# EAGLE design shield (EAGLE 7.1.0)
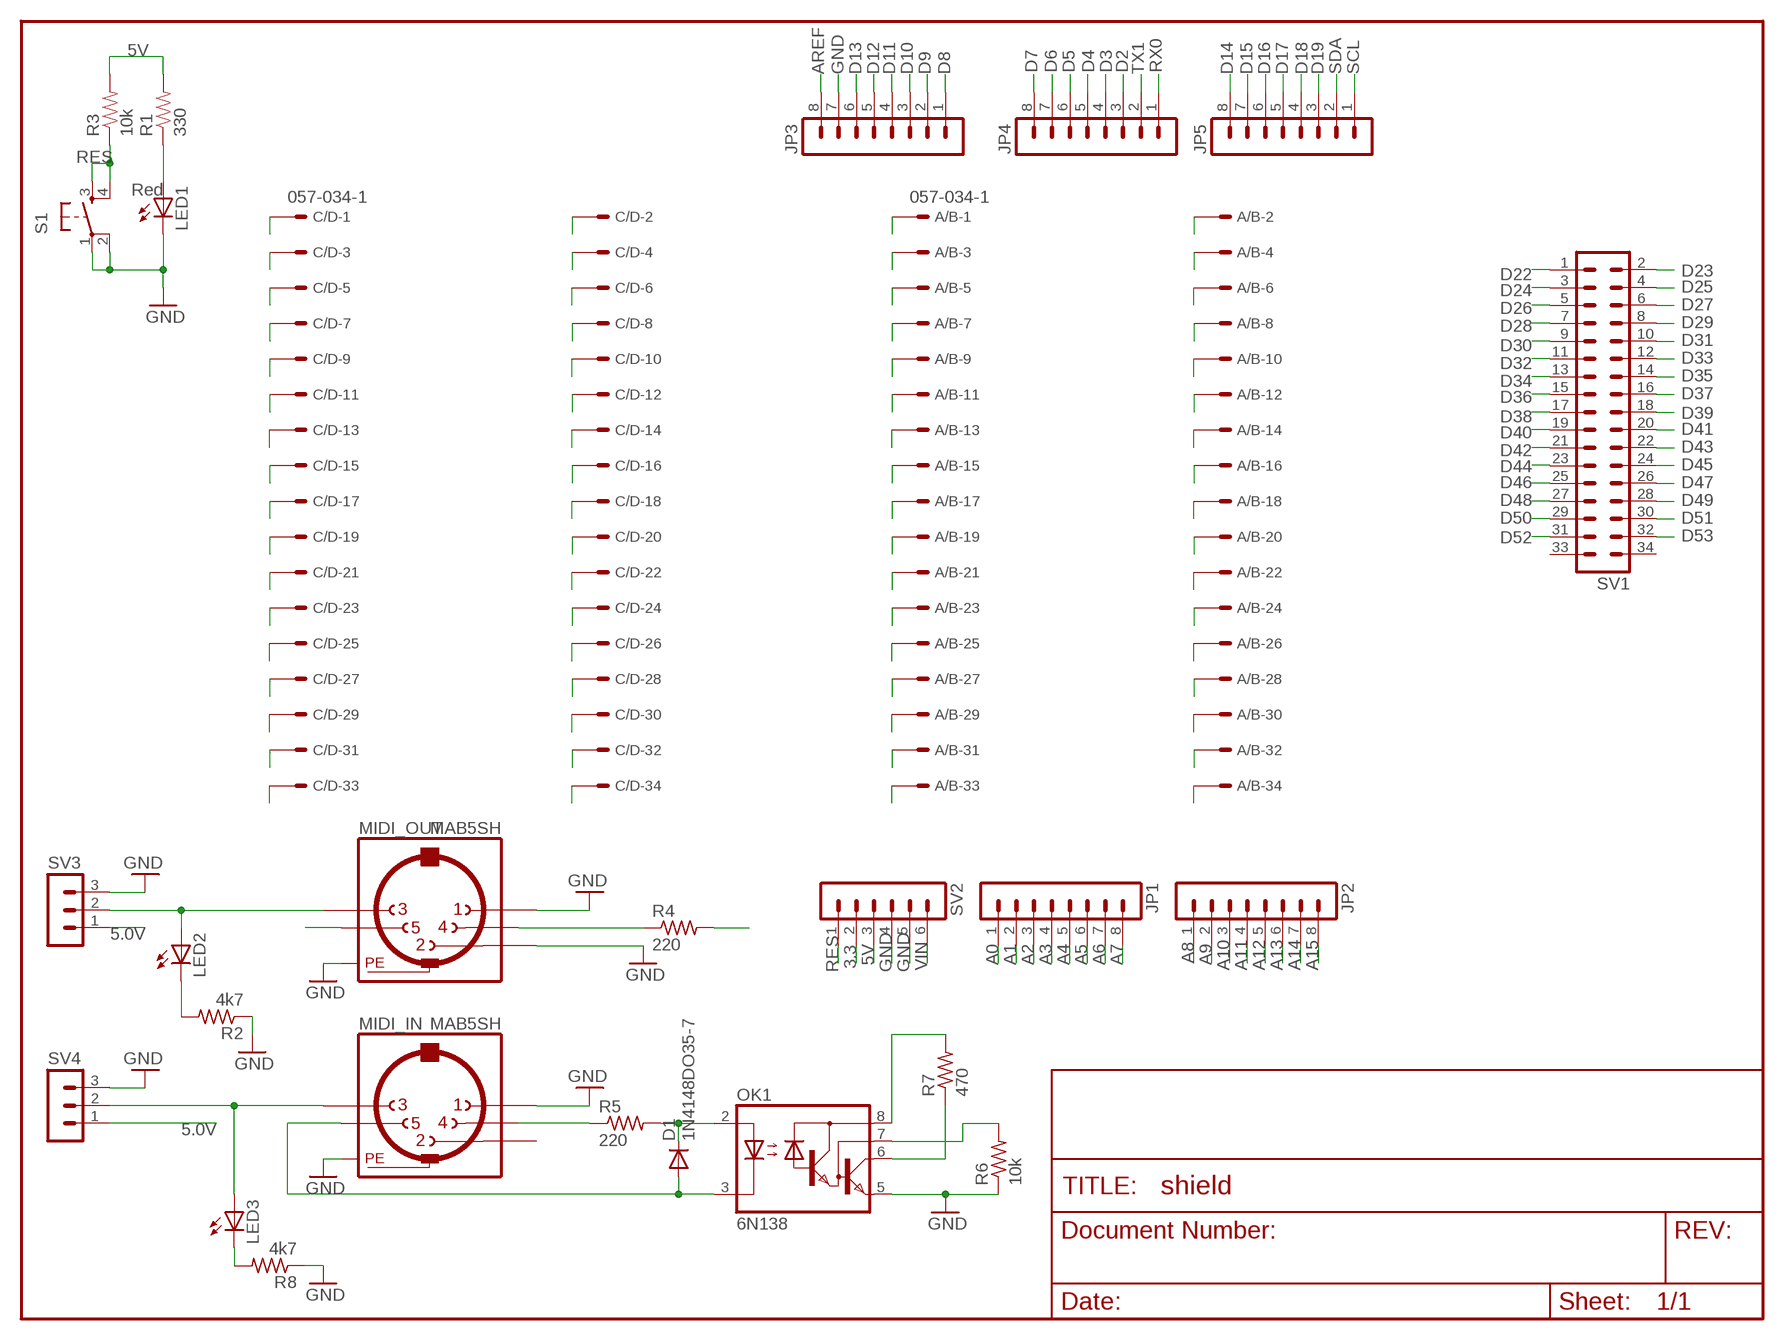
[diagram p0: schematic, sheet 1]

## Parts
A/B  057-034-1  [057-034-1]
C/D  057-034-1  [057-034-1]
D1  1N4148DO35-7  [DO35-7]
JP1  MA08-1  [MA08-1]
JP2  MA08-1  [MA08-1]
JP3  MA08-1  [MA08-1]
JP4  MA08-1  [MA08-1]
JP5  MA08-1  [MA08-1]
LED1  Red  LED5MM  [LED5MM]
LED2  LEDLSU260  [LSU260]
LED3  LEDLSU260  [LSU260]
MIDI_IN  MAB5SH  [MAB5SH]
MIDI_OUT  MAB5SH  [MAB5SH]
OK1  6N138  [DIL08]
R1  330  RESISTORPTH1  [AXIAL-0.3]
R2  4k7  R-US_0204/7  [0204/7]
R3  10k  RESISTORPTH1  [AXIAL-0.3]
R4  220  R-US_0204/7  [0204/7]
R5  220  R-US_0204/7  [0204/7]
R6  10k  R-US_0204/7  [0204/7]
R7  470  R-US_0204/7  [0204/7]
R8  4k7  R-US_0204/7  [0204/7]
S1  TAC_SWITCHPTH  [TACTILE-PTH]
SV1  MA17-2  [MA17-2]
SV2  MA06-1  [MA06-1]
SV3  MA03-1  [MA03-1]
SV4  MA03-1  [MA03-1]

## Nets
3.3: SV2.2
5V: A/B.33 C/D.2 C/D.33 OK1.8(VCC) R1.P$2 R3.P$2 R4.2 R7.2 SV2.3 SV3.1 SV4.1
A0: JP1.1
A1: JP1.2
A2: JP1.3
A3: JP1.4
A4: C/D.9 JP1.5
A5: C/D.11 JP1.6
A6: C/D.13 JP1.7
A7: C/D.15 JP1.8
A8: C/D.17 JP2.1
A9: C/D.19 JP2.2
A10: C/D.21 JP2.3
A11: C/D.23 JP2.4
A12: C/D.25 JP2.5
A13: C/D.27 JP2.6
A14: C/D.29 JP2.7
A15: C/D.31 JP2.8
AREF: JP3.8
D2: A/B.26 JP4.3
D3: A/B.24 JP4.4
D4: A/B.22 JP4.5
D5: A/B.20 JP4.6
D6: A/B.18 JP4.7
D7: A/B.16 JP4.8
D8: A/B.14 JP3.1
D9: A/B.12 JP3.2
D10: A/B.10 JP3.3
D11: A/B.8 JP3.4
D12: A/B.6 JP3.5
D13: A/B.4 JP3.6
D14: JP5.8
D15: JP5.7
D16: JP5.6
D17: JP5.5
D18: JP5.4 MIDI_OUT.5
D19: JP5.3 OK1.6(VO) R7.1
D22: A/B.9 SV1.1
D23: A/B.11 SV1.2
D24: A/B.13 SV1.3
D25: A/B.15 SV1.4
D26: A/B.17 SV1.5
D27: A/B.19 SV1.6
D28: A/B.21 SV1.7
D29: A/B.31 SV1.8
D30: A/B.29 SV1.9
D31: A/B.27 SV1.10
D32: A/B.25 SV1.11
D33: A/B.23 SV1.12
D34: C/D.4 SV1.13
D35: C/D.6 SV1.14
D36: C/D.8 SV1.15
D37: C/D.10 SV1.16
D38: C/D.12 SV1.17
D39: C/D.14 SV1.18
D40: C/D.16 SV1.19
D41: C/D.18 SV1.20
D42: C/D.20 SV1.21
D43: C/D.22 SV1.22
D44: C/D.24 SV1.23
D45: C/D.26 SV1.24
D46: SV1.25
D47: SV1.26
D48: SV1.27
D49: SV1.28
D50: SV1.29
D51: SV1.30
D52: SV1.31
D53: SV1.32
GND: A/B.34 C/D.34 JP3.7 LED1.K(C) MIDI_IN.1 MIDI_IN.PE MIDI_IN.PE@(PE) MIDI_OUT.1 MIDI_OUT.2 MIDI_OUT.PE MIDI_OUT.PE@(PE) OK1.5(GND) R2.1 R6.1 R8.1 S1.1 S1.2 SV2.4 SV2.5 SV3.3 SV4.3
N$1: LED3.A MIDI_IN.3 SV4.2
N$2: LED2.A MIDI_OUT.3 SV3.2
N$3: MIDI_OUT.4 R4.1
N$4: LED2.K(C) R2.2
N$5: D1.C OK1.2(A) R5.2
N$6: MIDI_IN.4 R5.1
N$7: D1.A MIDI_IN.5 OK1.3(C)
N$8: OK1.7(VB) R6.2
N$10: A/B.1
N$13: LED3.K(C) R8.2
N$19: A/B.2
N$24: A/B.3
N$25: A/B.5
N$26: A/B.7
N$31: A/B.28
N$32: C/D.1
N$40: C/D.32
N$41: C/D.28
N$42: C/D.30
N$51: C/D.3
N$52: C/D.5
N$53: C/D.7
N$76: A/B.30
N$77: A/B.32
N$126: LED1.A R1.P$1
RES: R3.P$1 S1.3 S1.4 SV2.1
RX0: JP4.1
SCL: JP5.1
SDA: JP5.2
TX1: JP4.2
VIN: SV2.6
Unconnected: MIDI_IN.2 SV1.33 SV1.34

## Library data of the parts
A/B C/D = con-panduit:057-034-: CONNECTOR 34-pin series 057 contact pc board low profile headers; OC_FARNELL: unknown; OC_NEWARK: unknown
D1 = diode:1N4148: DIODE high speed (Philips)
JP1-JP5 = con-lstb:MA08-1: PIN HEADER; OC_FARNELL: unknown; OC_NEWARK: unknown
LED1 = SparkFun:LED: LEDs Standard schematic elements and footprints for 5mm, 3mm, 1206, and 0603 sized LEDs. 5mm - Spark Fun Electronics SKU : COM-00529 (and others)
LED2 LED3 = led:LED: LED OSRAM: - CHIPLED LG R971, LG N971, LY N971, LG Q971, LY Q971, LO R971, LY R971 LH N974, LH R974 LS Q976, LO Q976, LY Q976 LO Q996 - Hyper CHIPLED LW Q18S LB Q993, LB Q99A, LB R99A - SideLED LS A670, LO A670, LY A670, LG A670, LP A670 LB A673, LV A673, LT A673, LW A673 LH A674 LY A675 LS A676, LA A676, LO A676, LY A676, LW A676 LS A679, LY A679, LG A679 - Hyper Micro SIDELED® LS Y876, LA Y876, LO Y876, LY Y876 LT Y87S - SmartLED LW L88C, LW L88S LB L89C, LB L89S, LG L890 LS L89K, LO L89K, LY L89K LS L896, LA L896, LO L896, LY L896 - TOPLED LS T670, LO T670, LY T670, LG T670, LP T670 LSG T670, LSP T670, LSY T670, LOP T670, LYG T670 LG T671, LOG T671, LSG T671 LB T673, LV T673, LT T673, LW T673 LH T674 LS T676, LA T676, LO T676, LY T676, LB T676, LH T676, LSB T676, LW T676 LB T67C, LV T67C, LT T67C, LS T67K, LO T67K, LY T67K, LW E67C LS E67B, LA E67B, LO E67B, LY E67B, LB E67C, LV E67C, LT E67C LW T67C LS T679, LY T679, LG T679 LS T770, LO T770, LY T770, LG T770, LP T770 LB T773, LV T773, LT T773, LW T773 LH T774 LS E675, LA E675, LY E675, LS T675 LS T776, LA T776, LO T776, LY T776, LB T776 LHGB T686 LT T68C, LB T68C - Hyper Mini TOPLED® LB M676 - Mini TOPLED Santana® LG M470 LS M47K, LO M47K, LY M47K Source: http://www.osram.convergy.de LUXEON: - LUMILED® LXK2-PW12-R00, LXK2-PW12-S00, LXK2-PW14-U00, LXK2-PW14-V00 LXK2-PM12-R00, LXK2-PM12-S00, LXK2-PM14-U00 LXK2-PE12-Q00, LXK2-PE12-R00, LXK2-PE12-S00, LXK2-PE14-T00, LXK2-PE14-U00 LXK2-PB12-K00, LXK2-PB12-L00, LXK2-PB12-M00, LXK2-PB14-N00, LXK2-PB14-P00, LXK2-PB14-Q00 LXK2-PR12-L00, LXK2-PR12-M00, LXK2-PR14-Q00, LXK2-PR14-R00 LXK2-PD12-Q00, LXK2-PD12-R00, LXK2-PD12-S00 LXK2-PH12-R00, LXK2-PH12-S00 LXK2-PL12-P00, LXK2-PL12-Q00, LXK2-PL12-R00 Source: www.luxeon.com KINGBRIGHT: KA-3528ASYC Source: www.kingbright.com
MIDI_IN MIDI_OUT = con-hirschmann:MAB5SH: Female CONNECTOR 5 pins 90 deg. with shield, horizontal (DIN 41524); OC_FARNELL: 809883; OC_NEWARK: unknown
OK1 = optocoupler:6N138: MOTOROLA OPTO COUPLER; MF: VISHAY/TELEFUNKEN; MPN: 6N138; OC_FARNELL: 9860150; OC_NEWARK: 35K5294
R1 R3 = SparkFun:RESISTOR: Resistor Basic schematic elements and footprints for 0603, 1206, and PTH 1/10th watt (small) resistors.
R2 R8 = resistor:R-US_: RESISTOR, American symbol
R4-R7 = rcl:R-US_: RESISTOR, American symbol
S1 = SparkFun:TAC_SWITCH: Momentary Switch Button commonly used for reset or general input. Spark Fun Electronics SKU : COM-00097
SV1 = con-lstb:MA17-2: PIN HEADER; OC_FARNELL: unknown; OC_NEWARK: unknown
SV2 = con-lstb:MA06-1: PIN HEADER; OC_FARNELL: unknown; OC_NEWARK: unknown
SV3 SV4 = con-lstb:MA03-1: PIN HEADER; OC_FARNELL: unknown; OC_NEWARK: unknown

## Board
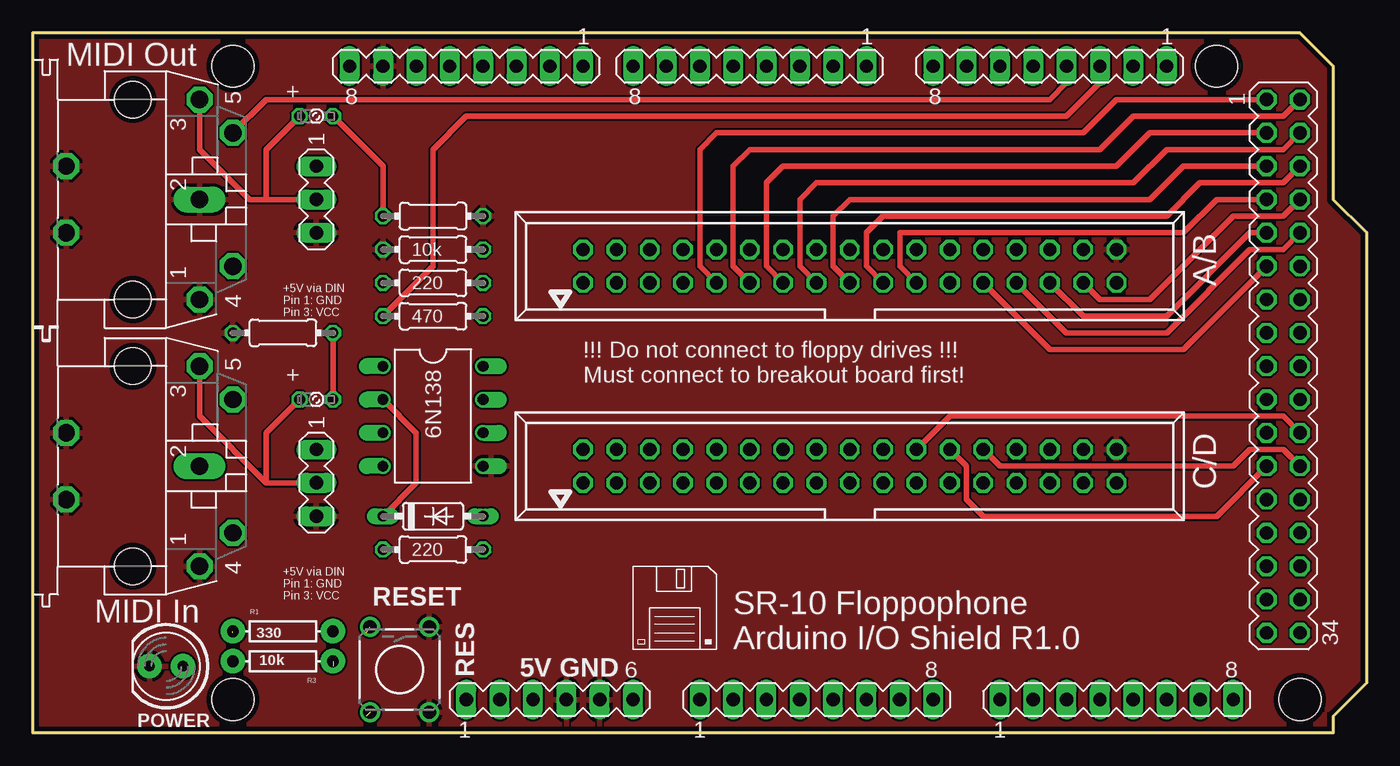
[diagram p1: board, top side]
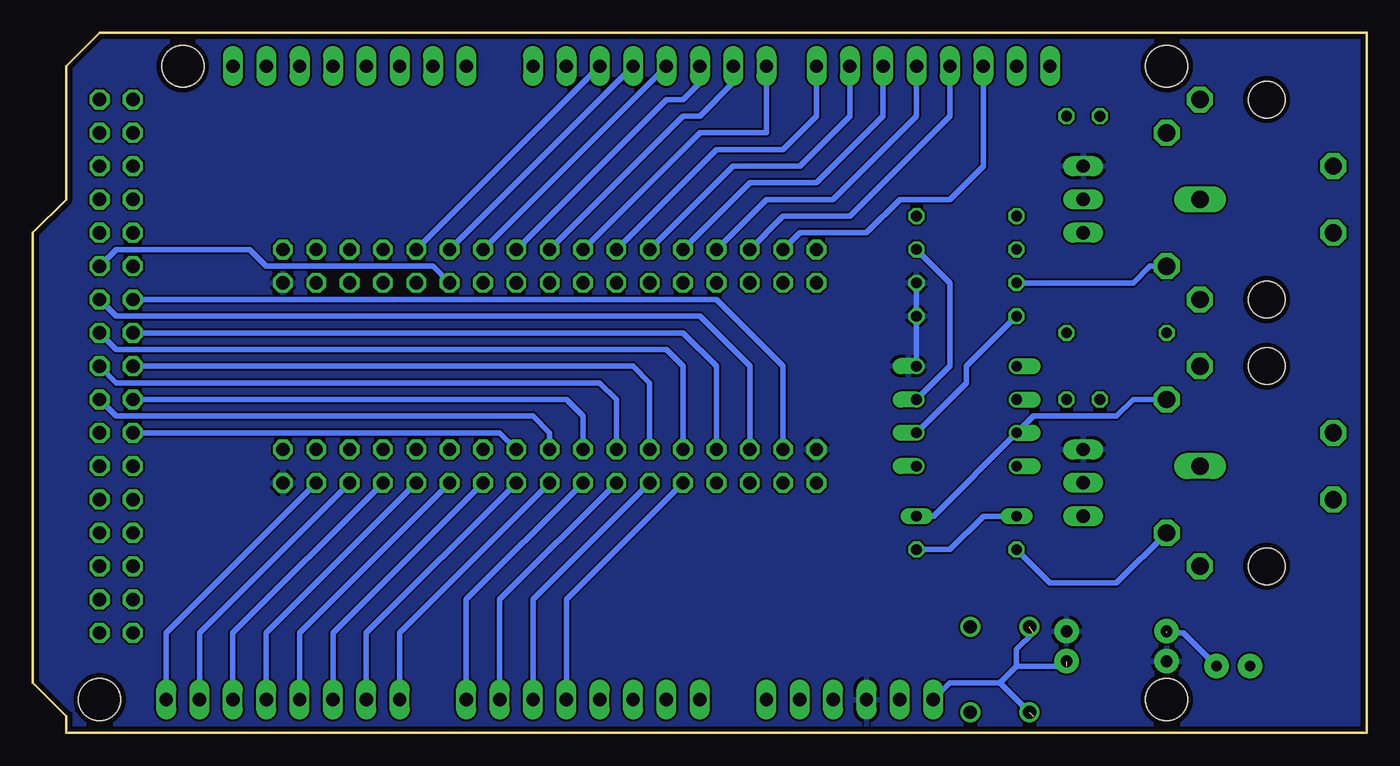
[diagram p2: board, bottom side, seen from below]

Size 101.6 x 53.34 mm. Coordinates in mm from the lower left corner, seen from the top.
Outline: 0,0 99.06,0 99.06,1.27 101.6,3.81 101.6,38.1 99.06,40.64 99.06,50.8 96.52,53.34 0,53.34 0,0
Copper layers (1*16): Top 0.0356mm / dielectric 1.5011mm / Bottom 0.0356mm
Design rules "OSHPark": minimum track width 6mil, minimum drill 13mil, track to track 6mil, track to pad 6mil, pad to pad 6mil, via to via 6mil, smd to smd 6mil, copper to edge 15mil, drill to drill 6mil, minimum pad ring 7mil, minimum via ring 7mil, stop-mask expansion 3mil, vias tented up to drill 0mil, thermal gap 10mil
Holes 3.2 mm at 15.24,2.54 90.17,50.8 96.52,2.54 15.24,50.8

### Footprints (pad centres in the part's own frame; a part is rotated, then mirrored left to right if it is on the bottom)
057-034-1 = drill 1 octagon: 1 -20.32,-1.27; 2 -20.32,1.27; 3 -17.78,-1.27; 4 -17.78,1.27; 5 -15.24,-1.27; 6 -15.24,1.27; 7 -12.7,-1.27; 8 -12.7,1.27; 9 -10.16,-1.27; 10 -10.16,1.27; 11 -7.62,-1.27; 12 -7.62,1.27; 13 -5.08,-1.27; 14 -5.08,1.27; 15 -2.54,-1.27; 16 -2.54,1.27; 17 0,-1.27; 18 0,1.27; 19 2.54,-1.27; 20 2.54,1.27; 21 5.08,-1.27; 22 5.08,1.27; 23 7.62,-1.27; 24 7.62,1.27; 25 10.16,-1.27; 26 10.16,1.27; 27 12.7,-1.27; 28 12.7,1.27; 29 15.24,-1.27; 30 15.24,1.27; 31 17.78,-1.27; 32 17.78,1.27; 33 20.32,-1.27; 34 20.32,1.27
DO35-7 = drill 0.813 long: A 3.81,0; C -3.81,0
MA08-1 = drill 1.016 long: 1 -8.89,0; 2 -6.35,0; 3 -3.81,0; 4 -1.27,0; 5 1.27,0; 6 3.81,0; 7 6.35,0; 8 8.89,0
LED5MM = drill 0.813 pad 1.88: A -1.27,0; K 1.27,0
LSU260 = drill 0.813 octagon: A -1.27,0; K 1.27,0
MAB5SH = drill 1.321 octagon: 1 7.62,5.08; 3 -7.62,5.08; 4 5.08,7.62; 5 -5.08,7.62; PE -2.54,-5.08; PE@ 2.54,-5.08 | drill 1.321 long: 2 0,5.08 | hole 2.794: 7.62,0; -7.62,0
DIL08 = drill 0.813 offset: 1 -3.81,-3.81; 2 -1.27,-3.81; 3 1.27,-3.81; 4 3.81,-3.81; 5 3.81,3.81; 6 1.27,3.81; 7 -1.27,3.81; 8 -3.81,3.81
AXIAL-0.3 = drill 0.9 pad 1.88: P$1 -3.81,0; P$2 3.81,0
0204/7 = drill 0.813 octagon: 1 -3.81,0; 2 3.81,0
TACTILE-PTH = drill 1.016: 1 -3.251,2.261; 2 3.251,2.261; 3 -3.251,-2.261; 4 3.251,-2.261
MA17-2 = drill 1.016 octagon: 1 -20.32,-1.27; 2 -20.32,1.27; 3 -17.78,-1.27; 4 -17.78,1.27; 5 -15.24,-1.27; 6 -15.24,1.27; 7 -12.7,-1.27; 8 -12.7,1.27; 9 -10.16,-1.27; 10 -10.16,1.27; 11 -7.62,-1.27; 12 -7.62,1.27; 13 -5.08,-1.27; 14 -5.08,1.27; 15 -2.54,-1.27; 16 -2.54,1.27; 17 0,-1.27; 18 0,1.27; 19 2.54,-1.27; 20 2.54,1.27; 21 5.08,-1.27; 22 5.08,1.27; 23 7.62,-1.27; 24 7.62,1.27; 25 10.16,-1.27; 26 10.16,1.27; 27 12.7,-1.27; 28 12.7,1.27; 29 15.24,-1.27; 30 15.24,1.27; 31 17.78,-1.27; 32 17.78,1.27; 33 20.32,-1.27; 34 20.32,1.27
MA06-1 = drill 1.016 long: 1 -6.35,0; 2 -3.81,0; 3 -1.27,0; 4 1.27,0; 5 3.81,0; 6 6.35,0
MA03-1 = drill 1.016 long: 1 -2.54,0; 2 0,0; 3 2.54,0

### Placement (x,y rotation side)
A/B  62.23,35.56 0 top
C/D  62.23,20.32 0 top
D1  30.48,16.51 0 top
JP1  59.69,2.54 0 top
JP2  82.55,2.54 0 top
JP3  33.02,50.8 180 top
JP4  54.61,50.8 180 top
JP5  77.47,50.8 180 top
LED1  10.16,5.08 180 top
LED2  21.59,46.99 0 top
LED3  21.59,25.4 0 top
MIDI_IN  7.62,20.32 270 top
MIDI_OUT  7.62,40.64 270 top
OK1  30.48,24.13 270 top
R1  19.05,7.75 0 top
R2  30.48,39.37 180 top
R3  19.05,5.46 180 top
R4  30.48,34.29 0 top
R5  30.48,13.97 0 top
R6  30.48,36.83 0 top
R7  30.48,31.75 0 top
R8  19.05,30.48 0 top
S1  27.94,4.83 270 top
SV1  95.25,27.94 270 top
SV2  39.37,2.54 0 top
SV3  21.59,40.64 270 top
SV4  21.59,19.05 270 top

### Tracks (layer width: path | path; a pad name or v marks a point on that pad's centre or on a via)
5V
  Bottom 0.406: OK1.8 R7.2 R4.2
  pour Bottom: 0,53.34 0,0 99.06,0 99.06,1.27 101.6,3.81 101.6,38.1 99.06,40.64 99.06,50.8 96.52,53.34
A2
  Bottom 0.406: 55.88,3.81 JP1.3
A3
  Bottom 0.406: 58.42,3.81 JP1.4
A4
  Bottom 0.406: JP1.5 60.96,10.16 C/D.9
A5
  Bottom 0.406: 63.5,3.81 JP1.6 63.5,10.16 C/D.11
A6
  Bottom 0.406: JP1.7 66.04,10.16 C/D.13
A7
  Bottom 0.406: JP1.8 68.58,10.16 C/D.15
A8
  Bottom 0.406: JP2.1 73.66,7.62 C/D.17
A9
  Bottom 0.406: JP2.2 76.2,7.62 C/D.19
A10
  Bottom 0.406: JP2.3 78.74,7.62 C/D.21
A11
  Bottom 0.406: JP2.4 81.28,7.62 C/D.23
A12
  Bottom 0.406: JP2.5 83.82,7.62 C/D.25
A13
  Bottom 0.406: JP2.6 86.36,7.62 C/D.27
A14
  Bottom 0.406: JP2.7 88.9,7.62 C/D.29
A15
  Bottom 0.406: JP2.8 91.44,7.62 C/D.31
D2
  Bottom 0.406: JP4.3 A/B.26
D3
  Bottom 0.406: A/B.24 JP4.4
D4
  Bottom 0.406: JP4.5 A/B.22
D5
  Bottom 0.406: JP4.6 50.8,49.53 52.07,48.26 53.34,48.26 A/B.20
D6
  Bottom 0.406: JP4.7 48.26,49.53 50.8,46.99 52.07,46.99 A/B.18
D7
  Bottom 0.406: JP4.8 45.72,45.72 50.8,45.72 A/B.16
D8
  Bottom 0.406: JP3.1 41.91,46.99 44.45,44.45 49.53,44.45 A/B.14
D9
  Bottom 0.406: JP3.2 39.37,46.99 43.18,43.18 48.26,43.18 A/B.12
D10
  Bottom 0.406: JP3.3 36.83,46.99 41.91,41.91 46.99,41.91 A/B.10
D11
  Bottom 0.406: JP3.4 34.29,46.99 40.64,40.64 45.72,40.64 A/B.8
D12
  Bottom 0.406: A/B.6 44.45,39.37 39.37,39.37 31.75,46.99 JP3.5
D13
  Bottom 0.406: 29.21,49.53 JP3.6 29.21,43.18 31.75,40.64 35.56,40.64 38.1,38.1 43.18,38.1 A/B.4
D18
  Top 0.406: MIDI_OUT.5 17.78,48.26 77.47,48.26 78.74,49.53 JP5.4
D19
  Top 0.406: R7.1 30.48,35.56 30.48,44.45 33.02,46.99 78.74,46.99 81.28,49.53 JP5.3
  Bottom 0.406: OK1.6 30.48,26.67 30.48,27.94 R7.1
D22
  Top 0.406: A/B.9 50.8,35.56 50.8,44.45 52.07,45.72 80.01,45.72 82.55,48.26 SV1.1
D23
  Top 0.406: SV1.2 95.25,46.99 83.82,46.99 81.28,44.45 54.61,44.45 53.34,43.18 53.34,35.56 A/B.11
D24
  Top 0.406: A/B.13 55.88,35.56 55.88,41.91 57.15,43.18 82.55,43.18 85.09,45.72 SV1.3
D25
  Top 0.406: SV1.4 95.25,44.45 86.36,44.45 83.82,41.91 59.69,41.91 58.42,40.64 58.42,35.56 A/B.15
D26
  Top 0.406: A/B.17 60.96,35.56 60.96,39.37 62.23,40.64 85.09,40.64 87.63,43.18 SV1.5
D27
  Top 0.406: SV1.6 95.25,41.91 88.9,41.91 86.36,39.37 64.77,39.37 63.5,38.1 63.5,35.56 A/B.19
D28
  Top 0.406: A/B.21 66.04,35.56 66.04,38.1 87.63,38.1 90.17,40.64 SV1.7
D29
  Top 0.406: SV1.8 95.25,39.37 91.44,39.37 85.09,33.02 81.28,33.02 A/B.31
D30
  Top 0.406: SV1.9 92.71,38.1 86.36,31.75 80.01,31.75 A/B.29
D31
  Top 0.406: A/B.27 78.74,30.48 86.36,30.48 92.71,36.83 95.25,36.83 SV1.10
D32
  Top 0.406: A/B.25 77.47,29.21 87.63,29.21 SV1.11
D33
  Bottom 0.406: SV1.12 95.25,36.83 85.09,36.83 83.82,35.56 71.12,35.56 A/B.23
D34
  Bottom 0.406: C/D.4 44.45,27.94 49.53,33.02 SV1.13
D35
  Bottom 0.406: SV1.14 95.25,31.75 50.8,31.75 46.99,27.94 C/D.6
D36
  Bottom 0.406: C/D.8 49.53,27.94 52.07,30.48 SV1.15
D37
  Bottom 0.406: SV1.16 95.25,29.21 53.34,29.21 52.07,27.94 C/D.10
D38
  Bottom 0.406: C/D.12 54.61,26.67 55.88,27.94 SV1.17
D39
  Bottom 0.406: SV1.18 95.25,26.67 58.42,26.67 57.15,25.4 C/D.14
D40
  Bottom 0.406: C/D.16 59.69,24.13 60.96,25.4 SV1.19
D41
  Bottom 0.406: SV1.20 95.25,24.13 63.5,24.13 62.23,22.86 C/D.18
D42
  Bottom 0.406: C/D.20 66.04,22.86 SV1.21
D43
  Top 0.406: SV1.22 95.25,24.13 69.85,24.13 C/D.22
D44
  Top 0.406: C/D.24 71.12,20.32 71.12,17.78 72.39,16.51 90.17,16.51 SV1.23
D45
  Top 0.406: SV1.24 95.25,21.59 92.71,21.59 91.44,20.32 73.66,20.32 C/D.26
GND
  pour Top: 0,53.34 0,0 99.06,0 99.06,1.27 101.6,3.81 101.6,38.1 99.06,40.64 99.06,50.8 96.52,53.34
N$1
  Top 0.406: 20.32,19.05 SV4.2 17.78,19.05 | 17.78,19.05 12.7,24.13 MIDI_IN.3 | 17.78,19.05 17.78,22.86 LED3.A
N$2
  Top 0.406: 20.32,40.64 SV3.2 17.78,40.64 | 17.78,40.64 16.51,40.64 12.7,44.45 MIDI_OUT.3 | 17.78,40.64 17.78,44.45 LED2.A
N$3
  Bottom 0.406: MIDI_OUT.4 16.51,35.56 17.78,34.29 R4.1
N$4
  Top 0.406: LED2.K 26.67,43.18 R2.2
N$5
  Top 0.406: D1.C 29.21,19.05 29.21,22.86 OK1.2
  Bottom 0.406: R5.2 31.75,13.97 29.21,16.51 D1.C
N$6
  Bottom 0.406: R5.1 24.13,11.43 19.05,11.43 MIDI_IN.4
N$7
  Bottom 0.406: D1.A 33.02,16.51 OK1.3 | OK1.3 25.4,22.86 | MIDI_IN.5 17.78,25.4 19.05,24.13 25.4,24.13 OK1.3
N$8
  Bottom 0.406: OK1.7 31.75,27.94 31.75,34.29 R6.2
N$13
  Top 0.406: R8.2 LED3.K
N$126  (1 unrouted)
  Bottom 0.406: LED1.A 13.97,7.62 15.24,7.62
RES  (3 unrouted)
  Bottom 0.406: SV2.1 31.75,3.81 27.94,3.81 | 27.94,3.81 25.4,1.27 | 27.94,3.81 26.67,5.08 | 26.67,5.08 22.86,5.08 | 26.67,5.08 26.67,6.35 25.4,7.62
TX1
  Top 0.406: JP4.2 60.96,49.53

### Text on the board
tPlace: MIDI Out | + | +5V via DIN / Pin 1: GND / Pin 3: VCC | + | !!! Do not connect to floppy drives !!! / Must connect to breakout board first! | MIDI In | +5V via DIN / Pin 1: GND / Pin 3: VCC | RESET | SR-10 Floppophone / Arduino I/O Shield R1.0 | RES | 5V | GND | POWER